# EAGLE design Lipo Rider Plus (EAGLE 9.4.2)
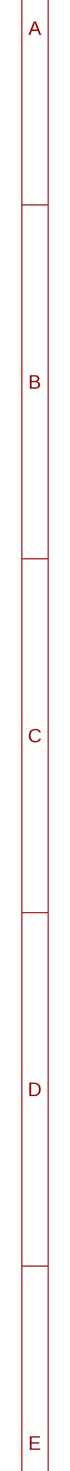
[diagram p0: schematic, sheet 1, part 1 of 2]
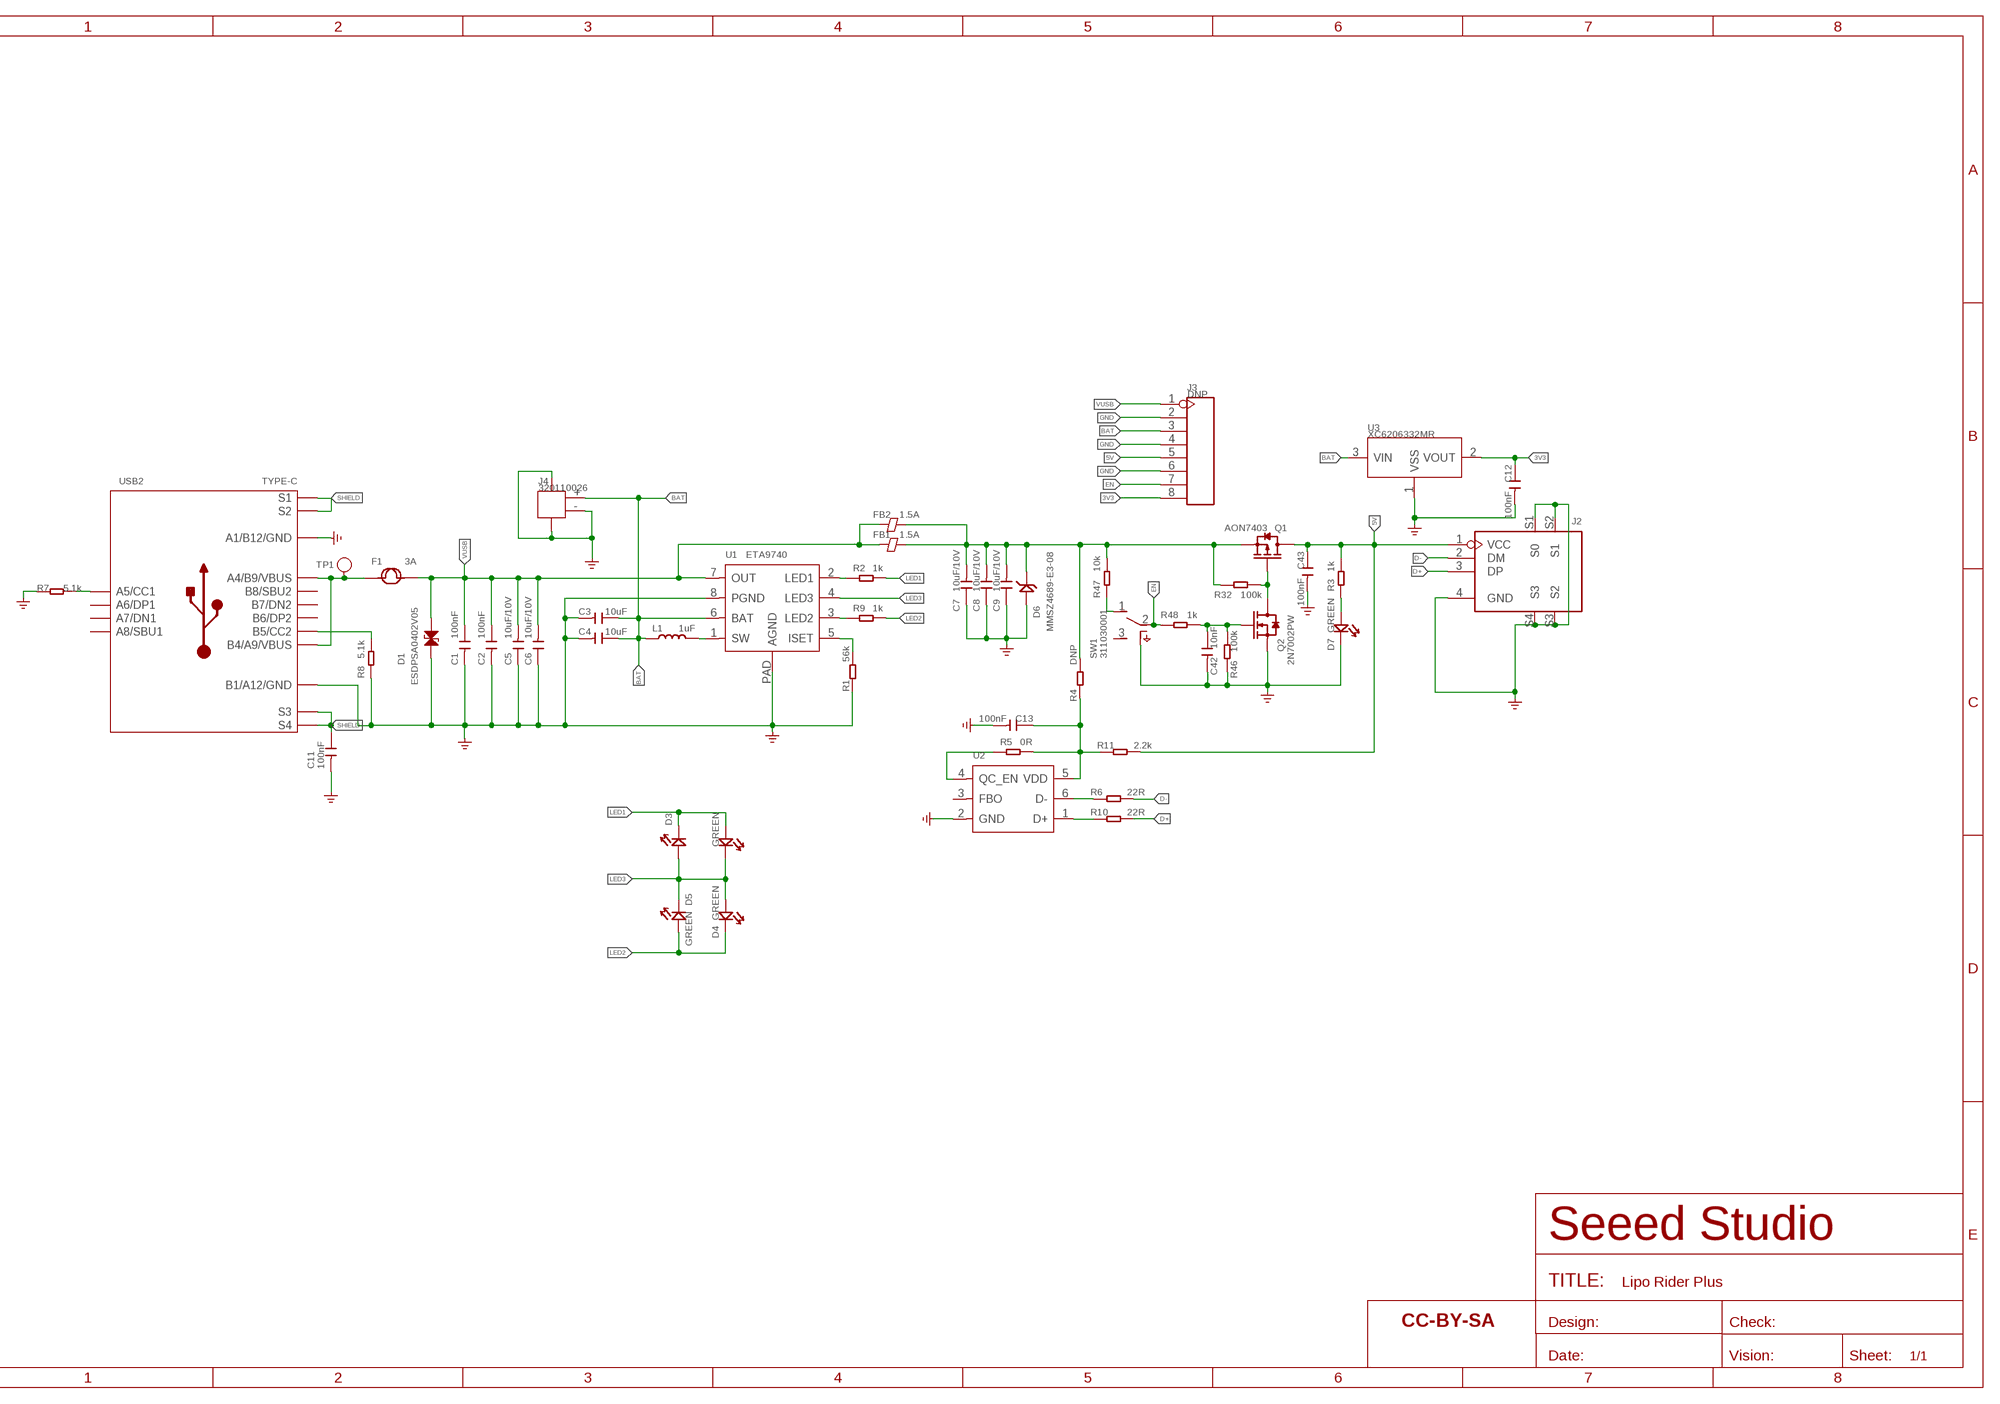
[diagram p1: schematic, sheet 1, part 2 of 2]

## Parts
C1  100nF  CAP-0402  [C0402]
C2  100nF  CAP-0402  [C0402]
C3  10uF  CAP-0603  [C0603]
C4  10uF  CAP-0603  [C0603]
C5  10uF/10V  CAP-0805  [C0805]
C6  10uF/10V  CAP-0805  [C0805]
C7  10uF/10V  CAP-0805  [C0805]
C8  10uF/10V  CAP-0805  [C0805]
C9  10uF/10V  CAP-0805  [C0805]
C11  100nF  CAP-0402  [C0402]
C12  100nF  CAP-0402  [C0402]
C13  100nF  CAP-0402  [C0402]
C42  10nF  CAP-0402  [C0402]
C43  100nF  CAP-0402  [C0402]
D1  ESDPSA0402V05  D-ESD-2P-DOUBLE-0402  [ESD-0402]
D2  GREEN  LED-0402  [LED-0402]
D3  GREEN  LED-0402  [LED-0402]
D4  GREEN  LED-0402  [LED-0402]
D5  GREEN  LED-0402  [LED-0402]
D6  MMSZ4689-E3-08  D-ZENER-2P-304030008  [SOD-123]
D7  GREEN  LED-0402  [LED-0402]
F1  3A  FUSE'1812'  [F1812]
FB1  1.5A  FERRITE-BEAD-0805  [F0805]
FB2  1.5A  FERRITE-BEAD-0805  [F0805]
FR1  SEEEDSTUDIO-OPEN-SCH-FRAME-BIG  [SEEEDSTUDIO-PCB-FRAME]
J2  USB4+4P-SMD+DIP  [USB4+4P-2.0-14.6X10.6X5.72MM]
J3  DNP  HEADER-8P-65/35MIL  [H8-2.54-C65D35MIL]
J4  320110026  JST-2P-SMD'2.0'  [HW2-SMD-2.0-90D]
L1  1uF  INDUCTOR-4430  [L4.4X3.0MM]
Q1  AON7403  MOSFET-P-AON7403  [DFN8P-0.65-3X3X0.8MM]
Q2  2N7002PW  MOSFET-N'SI1304BDL'  [SOT-323]
R1  56k  RES-0402  [R0402]
R2  1k  RES-0402  [R0402]
R3  1k  RES-0402  [R0402]
R4  DNP  RES-0402  [R0402]
R5  0R  RES-0402  [R0402]
R6  22R  RES-0402  [R0402]
R7  5.1k  RES-0402  [R0402]
R8  5.1k  RES-0402  [R0402]
R9  1k  RES-0402  [R0402]
R10  22R  RES-0402  [R0402]
R11  2.2k  RES-0402  [R0402]
R32  100k  RES-0402  [R0402]
R46  100k  RES-0402  [R0402]
R47  10k  RES-0402  [R0402]
R48  1k  RES-0402  [R0402]
SW1  311030001  SWITCH-3+4P-311030001  [SW7-SMD-L6.7X2.7X3.2MM]
TP1  TEST  TEST-POINT'4545'  [TP-D45MIL]
U1  ETA9740  PMIC-ETA9740  [ESOP8L-1.27-5X3.9MM]
U2  CONTROLLER-FP6601Q  [SOT-23-6]
U3  XC6206332MR  PMIC-XC6206PMR  [SOT-23]
USB2  TYPE-C  USB2.0-TYPE-C  [USB2.0-TYPE-C]

## Nets
3V3: C12.1 J3.8 U3.2(VOUT)
5V: C43.1 J2.1(VCC) J3.5 Q1.5(D) Q1.6(D) Q1.7(D) Q1.8(D) Q1.9(D) R3.2 R11.2
BAT: C3.1 C4.1 J3.3 J4.+ L1.1 U1.6(BAT) U3.3(VIN)
D+: J2.3(DP) R10.2
D-: J2.2(DM) R6.2
EN: J3.7 R48.1 SW1.2(COM)
GND: C1.2 C2.2 C3.2 C4.2 C5.1 C6.1 C7.1 C8.1 C9.1 C11.2 C12.2 C13.2 C42.2 C43.2 D1.1 D6.+ D7.- J2.4(GND) J2.S1(S0) J2.S2(S1) J2.S3(S2) J2.S4(S3) J3.2 J3.4 J3.6 J4.3 J4.4 J4.- Q2.2(S) R1.1 R7.1 R8.2 R46.1 SW1.SS1(SS2) SW1.SS2 SW1.SS3(SS2) SW1.SS4(SS2) U1.8(PGND) U1.PAD(AGND) U2.2(GND) U3.1(VSS) USB2.A1_B12(A1/B12/GND) USB2.B1_A12(B1/A12/GND) ; supply symbol labelled GND_POWER
LED1: D2.+ D3.- R2.2
LED2: D4.- D5.+ R9.2
LED3: D2.- D3.+ D4.+ D5.- U1.4(LED3)
N$1: R7.2 USB2.A5(A5/CC1)
N$2: R8.1 USB2.B5(B5/CC2)
N$3: R47.1 SW1.1(A)
N$4: F1.1 TP1.T USB2.A4_B9(A4/B9/VBUS) USB2.B4_A9(B4/A9/VBUS)
N$6: D7.+ R3.1
N$7: R1.2 U1.5(ISET)
N$8: L1.2 U1.1(SW)
N$9: R9.1 U1.3(LED2)
N$10: R5.1 U2.4(QC_EN)
N$11: C13.1 R4.1 R5.2 R11.1 U2.5(VDD)
N$12: R2.1 U1.2(LED1)
N$13: R6.1 U2.6(D-)
N$14: R10.1 U2.1(D+)
N$49: Q1.4(G) Q2.3(D) R32.2
N$52: C42.1 Q2.1(G) R46.2 R48.2
SHIELD: C11.1 USB2.S1 USB2.S2 USB2.S3 USB2.S4 USB2.S5(S1) USB2.S6(S2)
VCC_5V: C7.2 C8.2 C9.2 D6.- FB1.2 FB2.2 Q1.1(S) Q1.2(S) Q1.3(S) R4.2 R32.1 R47.2
VUSB: C1.1 C2.1 C5.2 C6.2 D1.2 F1.2 FB1.1 FB2.1 J3.1 U1.7(OUT)
Unconnected: SW1.3(B) U2.3(FBO) USB2.A6(A6/DP1) USB2.A7(A7/DN1) USB2.A8(A8/SBU1) USB2.B6(B6/DP2) USB2.B7(B7/DN2) USB2.B8(B8/SBU2)

## Library data of the parts
C1-C9 C11-C13 C42 C43 = Discrete-new:CAP: Ceramic Capacitors
D1 = Discrete-new:D-ESD-2P-DOUBLE
D2-D5 D7 = Discrete-new:LED
D6 = Discrete-new:D-ZENER-2P
F1 = Discrete-new:FUSE
FB1 FB2 = Discrete-new:FERRITE-BEAD
FR1 = moudle-new:SEEEDSTUDIO-OPEN-SCH-FRAME-BIG
J2 = Connector-new:USB4+4P
J3 = Connector-new:HEADER-8P
J4 = Connector-new:JST-2P-SMD
L1 = Discrete-new:INDUCTOR
Q1 = Discrete-new:MOSFET-P
Q2 = Discrete-new:MOSFET-N: IRLL014: http://www.vishay.com/docs/91319/sihll014.pdf
R1-R11 R32 R46-R48 = Discrete-new:RES
SW1 = Discrete-new:SWITCH-3+4P
TP1 = Discrete-new:TEST-POINT; PARTNO: DNP
U1 = IC-new:PMIC-ETA9740
U2 = IC-new:CONTROLLER-FP6601Q
U3 = IC-new:PMIC-XC6206P: LOW ESR Cap.Compatible Positive Voltage Regulators
USB2 = Connector-new:USB2.0-TYPE-C

## Board
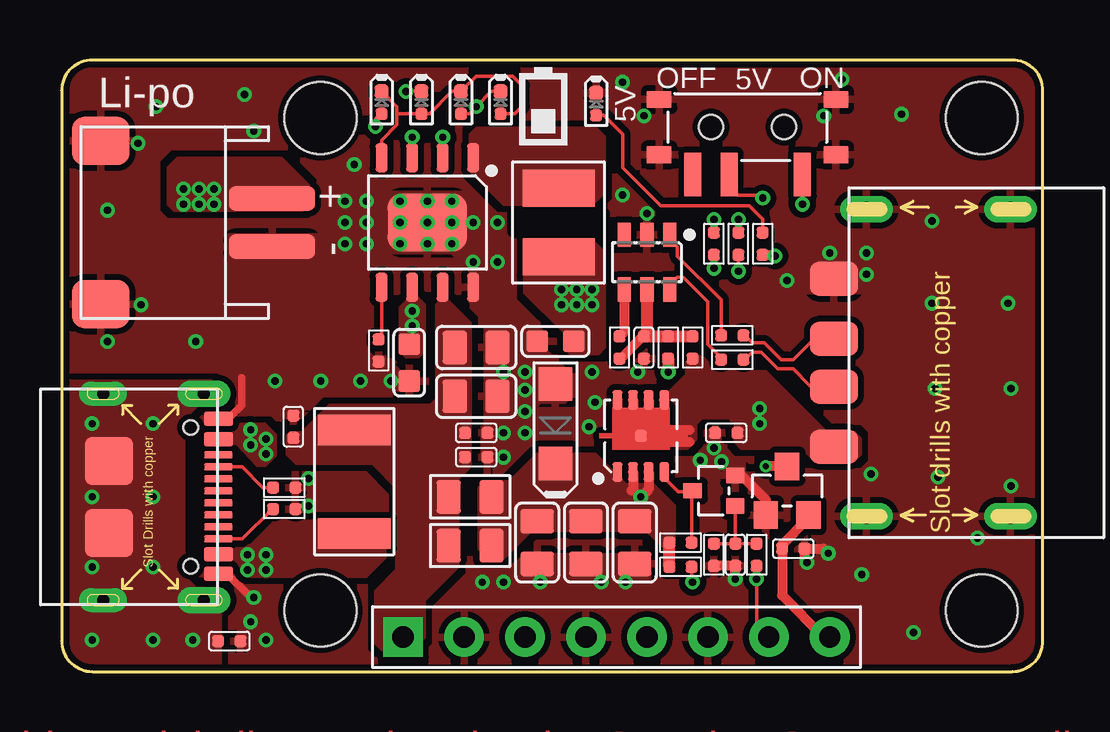
[diagram p2: board, top side]
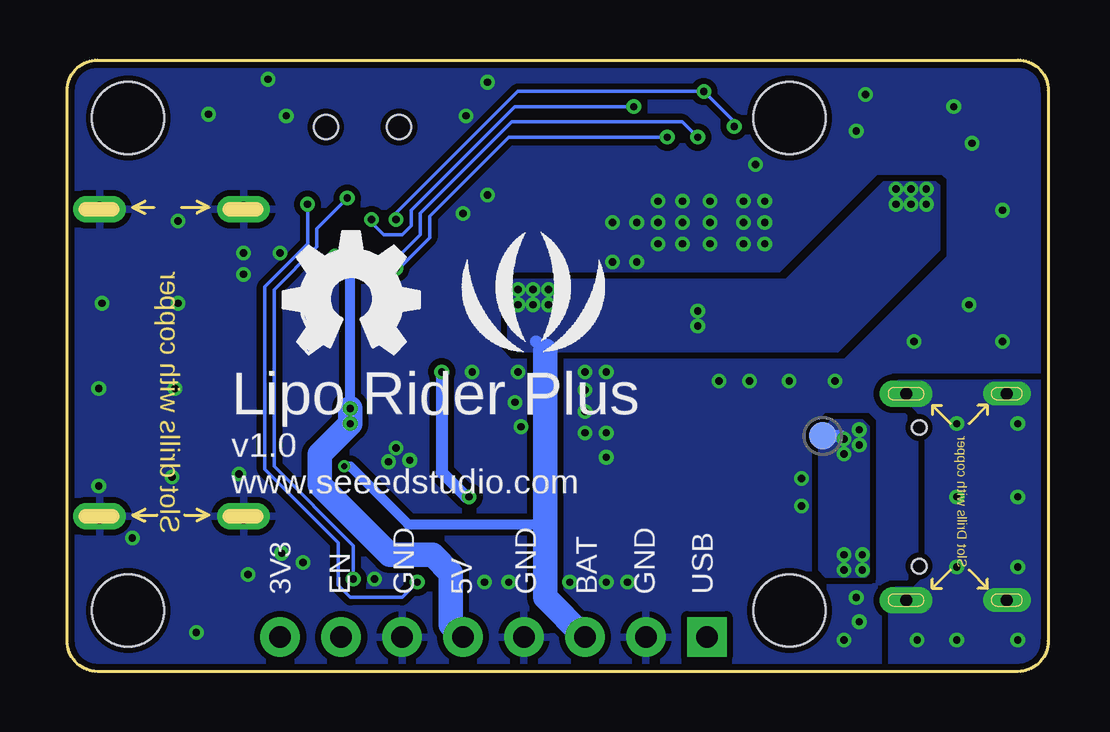
[diagram p3: board, bottom side, seen from below]

Size 40.88 x 25.48 mm. Coordinates in mm from the lower left corner, seen from the top.
Outline: 0,24.21 0,1.27 arc90 1.27,0 39.61,0 arc90 40.88,1.27 40.88,24.21 arc90 39.61,25.48 1.27,25.48 arc90 0,24.21
Copper layers (1*16): Top 0.035mm / dielectric 1.5mm / Bottom 0.035mm
Design rules "SeeedStudio_2layer_DRU_no_angle_20140221 *": minimum track width 1mil, minimum drill 10mil, track to track 6mil, track to pad 6mil, pad to pad 6mil, via to via 6mil, smd to smd 0mil, copper to edge 10mil, drill to drill 10mil, minimum pad ring 4mil, minimum via ring 4mil, stop-mask expansion 2mil, vias tented up to drill 25mil, thermal gap 10mil
Holes 3 mm at 10.78,23.07 10.78,2.54 38.34,23.07 38.34,2.54
tRestrict: area 18.8,18.3 to 22.6,19.1

### Footprints (pad centres in the part's own frame; a part is rotated, then mirrored left to right if it is on the bottom)
C0402 = smd 0.5 x 0.5: 1 -0.463,0; 2 0.463,0
C0603 = smd 0.889 x 0.889: 1 -0.762,0; 2 0.762,0
C0805 = smd 1.016 x 1.397: 1 -0.889,0; 2 0.889,0
ESD-0402 = smd 0.5 x 0.5: 1 -0.463,0; 2 0.463,0
LED-0402 = smd 0.5 x 0.5: + 0.463,0 | smd 0.58 x 0.58: - -0.468,0
SOD-123 = smd 1.397 x 1.397: + 1.651,0; - -1.651,0
F1812 = smd 1.27 x 3.048: 1 -2.159,0; 2 2.159,0
F0805 = smd 1.016 x 1.397: 1 -0.889,0; 2 0.889,0
USB4+4P-2.0-14.6X10.6X5.72MM = smd 1.4 x 2: 1 -3.5,0; 2 -1,0; 3 1,0; 4 3.5,0 | drill 0.6 pad 1.1 long: S1 -6.4,-1.35; S2 6.4,-1.35; S3 -6.4,-7.35; S4 6.4,-7.35
H8-2.54-C65D35MIL = drill 0.889 pad 1.651 square: 1 0,8.89 | drill 0.889 pad 1.651: 2 0,6.35; 3 0,3.81; 4 0,1.27; 5 0,-1.27; 6 0,-3.81; 7 0,-6.35; 8 0,-8.89
HW2-SMD-2.0-90D = smd 2 x 2.4: 3 3.4,-2.181; 4 -3.4,-2.181 | smd 1 x 3.6: + -1,4.953; - 1,4.953
L4.4X3.0MM = smd 1.55 x 3: 1 -1.425,0; 2 1.425,0
DFN8P-0.65-3X3X0.8MM = smd 0.8 x 0.4: 1 -1.5,0.975; 2 -1.5,0.325; 3 -1.5,-0.325; 4 -1.5,-0.975; 5 1.5,-0.975; 6 1.5,-0.325; 7 1.5,0.325; 8 1.5,0.975 | smd 0.508 x 0.508: 9 0,0
SOT-323 = smd 0.762 x 0.635: 1 0.889,-0.635; 2 0.889,0.635; 3 -0.889,0
R0402 = smd 0.5 x 0.5: 1 -0.463,0; 2 0.463,0
SW7-SMD-L6.7X2.7X3.2MM = smd 1.8 x 0.7: 1 1.978,2.286; 2 1.978,-0.762; 3 1.978,-2.286 | smd 0.7 x 1.016: SS1 -1.15,-3.683; SS2 1.15,-3.683; SS3 1.15,3.683; SS4 -1.15,3.683 | hole 1: 0,-1.524; 0,1.524
TP-D45MIL = smd 1.143 x 1.143: T 0,0
ESOP8L-1.27-5X3.9MM = smd 0.5 x 1.2: 1 -1.905,-2.7; 2 -0.635,-2.7; 3 0.635,-2.7; 4 1.905,-2.7; 5 1.905,2.7; 6 0.635,2.7; 7 -0.635,2.7; 8 -1.905,2.7 | smd 3.3 x 2.4: PAD 0,0
SOT-23-6 = smd 0.55 x 1.016: 1 -0.95,-1.143; 2 0,-1.143; 3 0.95,-1.143; 4 0.95,1.143; 5 0,1.143; 6 -0.95,1.143
SOT-23 = smd 1.016 x 1.143: 1 -0.889,-1.016; 2 0.889,-1.016; 3 0,1.016
USB2.0-TYPE-C = smd 1.2 x 0.6: A1_B12 0.05,3.25; A4_B9 0.05,2.4; B1_A12 0.05,-3.2; B4_A9 0.05,-2.4 | smd 1.2 x 0.3: A5 0.05,1.25; A6 0.05,0.25; A7 0.05,-0.25; A8 0.05,-1.25; B5 0.05,-1.75; B6 0.05,-0.75; B7 0.05,0.75; B8 0.05,1.75 | drill 0.5 pad 1 long: S1 -4.75,4.3; S2 -4.75,-4.3 | drill 0.5 pad 1.1 long: S3 -0.55,4.3; S4 -0.55,-4.3 | smd 2 x 2: S5 -4.5,1.5; S6 -4.5,-1.5 | hole 0.6: -1.1,-2.89; -1.1,2.89

### Placement (x,y rotation side)
C1  17.27,8.93 0 top
C2  17.27,9.95 0 top
C3  14.48,12.87 270 top
C4  20.57,13.76 180 top
C5  17.27,11.47 180 top
C6  17.27,13.5 180 top
C7  21.84,5.37 90 top
C8  19.81,5.37 90 top
C9  23.88,5.37 90 top
C11  6.99,1.27 0 top
C12  30.48,5.12 0 top
C13  24.26,13.5 270 top
C42  28.07,4.87 270 top
C43  27.69,9.95 180 top
D1  9.65,10.2 270 top
D2  13.34,23.7 270 top
D3  14.99,23.7 270 top
D4  18.29,23.7 270 top
D5  16.64,23.7 270 top
D6  20.57,10.33 90 top
D7  22.27,23.64 270 top
F1  12.19,7.91 90 top
FB1  17.02,5.25 0 top
FB2  17.02,7.28 0 top
FR1  -2.79,-7.58 0 top  (outside the outline)
J2  32.18,12.87 90 top
J3  23.11,1.44 90 top
J4  3.81,18.71 270 top
L1  20.7,18.71 90 top
Q1  24.13,9.82 90 top
Q2  27.18,7.53 0 top
R1  13.21,13.38 90 top
R2  27.18,17.82 90 top
R3  29.21,17.82 270 top
R4  25.27,13.5 270 top
R5  23.24,13.5 270 top
R6  27.94,12.99 0 top
R7  9.27,7.66 180 top
R8  9.27,6.77 0 top
R9  28.19,17.82 90 top
R10  27.94,14.01 0 top
R11  26.29,13.5 270 top
R32  25.78,5.37 0 top
R46  27.18,4.87 90 top
R47  25.78,4.36 180 top
R48  28.96,4.87 90 top
SW1  28.57,22.69 270 top
TP1  9.4,9.82 0 bottom
U1  15.24,18.71 180 top
U2  24.38,17.06 180 top
U3  30.23,7.53 0 top
U$1  [SEEED-SILK-TNAME-280*268MIL]  21.46,15.03 0 bottom
U$2  [OSHW_FILLX200_NOTEXT_TNAME]  31.88,13.25 0 bottom
USB2  6.48,7.28 0 top

### Tracks (layer width: path | path; a pad name or v marks a point on that pad's centre or on a via)
3V3
  Top 0.406: U3.2 31.11,6.39 30.02,5.29 C12.1 30.02,3.17 31.75,1.44 J3.8
5V  (via drill 0.3 pad 0.61)
  Top 0.406: 29.04,11.01 v29.08,10.96 | R3.2 29.67,17.36 v29.72,17.31 | Q1.5 25.11,10.54 25.02,10.45 | Q1.6 24.45,10.64 25.02,10.07 25.15,10.07 | Q1.7 23.8,10.4 23.88,10.33 | Q1.8 23.16,10.41 23.24,10.33 | 25.15,10.07 26.16,10.07 | 25.15,10.07 25.15,9.69 25.27,9.56 25.91,9.56 | 25.91,9.56 26.16,9.56 | 25.91,9.56 25.91,9.95
  Bottom 0.406: v29.08,10.96 29.08,16.68 v29.72,17.31
  Bottom 1.016: v29.08,10.96 v29.08,10.33 30.35,9.06 30.35,7.79 27.43,4.87 25.65,4.87 24.89,4.1 24.89,2.45 24.89,2.2 24.89,1.95 J3.5
  pour Top (isolate 0.254, no thermals): 33.02,8.8 31.37,8.8 30.86,9.31 28.32,9.31 28.07,9.56 28.07,10.33 27.81,10.58 26.67,10.58 26.42,10.33 26.42,9.67 26.06,9.31 23.37,9.31 22.99,9.69 22.99,10.58 23.24,10.84 24.89,10.84 25.15,11.09 25.15,11.47 26.04,12.36 26.04,12.87 26.29,13.12 26.67,13.12 27.3,12.49 29.34,12.49 31.88,9.95 33.02,9.95 33.27,9.69 33.27,9.06
BAT  (via drill 0.25 pad 0.51, 0.3 pad 0.61)
  Top 0.406: U3.3 v29.34,8.55
  Bottom 0.406: 20.95,6.26 21.08,6.14 26.67,6.14 29.08,8.55 v29.34,8.55
  Bottom 0.508: 20.95,13.38 C4.1
  Bottom 1.016: 20.95,13.38 20.95,6.26 20.95,3.09 J3.3
  other vias: 22.1,15.28 21.46,15.28 21.46,15.91 22.1,15.91 20.83,15.91 20.83,15.28 6.35,20.11 6.35,19.47 5.71,19.47 5.71,20.11 5.08,20.11 5.08,19.47 14.61,15.03 14.61,14.39
  pour Top (isolate 0.254, no thermals): 10.03,19.22 4.7,19.22 4.45,19.47 4.45,21 4.83,21.38 9.14,21.38 10.29,20.23 10.29,19.47
  pour Top (isolate 0.254, no thermals): 14.61,16.3 14.48,16.17 14.48,15.53 14.1,15.15 14.1,13.38 14.35,13.12 14.86,13.12 15.11,13.38 15.11,15.28 14.86,15.53 14.73,15.66 14.73,16.17
  pour Top (isolate 0.254, no thermals): 22.1,13.25 21.21,13.25 20.95,13.5 20.95,14.14 19.3,15.79 19.3,17.69 19.56,17.95 22.1,17.95 22.61,17.44 22.61,13.5 22.35,13.25
  pour Bottom (isolate 0.254, no thermals): 21.84,16.3 10.92,16.3 6.86,20.36 4.7,20.36 4.57,20.23 4.57,17.57 8.76,13.38 22.1,13.38 22.48,13.76 22.48,16.04 22.23,16.3
D+
  Top 0.152: R10.2 28.45,14.01 28.77,13.69 29.27,13.69 29.97,12.99 30.48,12.99 31.35,13.87 J2.3
D-
  Top 0.152: R6.2 28.45,12.99 28.77,13.31 29.15,13.31 29.84,12.61 30.48,12.61 31.18,11.91 31.23,11.87 J2.2
EN  (via drill 0.3 pad 0.61)
  Top 0.152: 28.96,4.49 R48.1 v28.96,3.85 28.96,1.95 J3.7 | v29.21,19.73 29.08,19.85 28.19,19.85 27.81,20.23 SW1.2
  Bottom 0.152: v28.96,3.85 28.96,5.25 32.26,8.55 32.26,15.91 30.48,17.69 30.48,18.45 v29.21,19.73
GND  (via drill 0.3 pad 0.61)
  Top 0.305: USB2.B1_A12 6.88,4.08 7.75,3.21 | USB2.A1_B12 6.93,10.53 7.49,11.09 7.49,12.23
  Top 0.406: R46.1 C42.2 v28.07,3.85 | Q2.2 28.32,8.17 29.34,7.15 U3.1 | v31.05,4.55 30.94,4.66 C12.2 31.75,5.12 v31.94,4.93
  other vias: 18.41,9.95 18.41,8.93 19.3,9.95 19.3,10.84 19.3,11.72 19.3,12.49 18.41,12.49 15.24,18.71 15.24,19.6 15.24,17.82 14.1,17.82 14.1,18.71 14.1,19.6 16.26,19.6 16.26,18.71 16.26,17.82 17.14,17.06 18.16,17.06 18.16,18.71 17.14,18.71 12.7,19.6 12.7,18.71 12.7,17.82 11.81,17.82 11.81,18.71 11.81,19.6 13.72,12.11 12.45,12.11 10.79,12.11 8.89,12.11 3.3,15.28 3.17,22.01 19.94,3.72 18.41,3.72 17.53,3.72 22.48,3.72 23.5,3.72 24,12.49 27.18,9.31 26.61,8.8 27.5,8.74 24.38,19.09 23.37,24.55 24.26,23.15 32.51,24.68 31.75,23.15 8,3.09 7.87,2.07 8.51,1.31 3.94,23.54 7.62,24.04 1.91,19.22 5.59,13.76 22.1,12.49 32,17.44 33.53,17.44 33.53,16.55 30.23,16.3 23.37,19.85 22.23,11.22 21.97,10.2 1.91,13.76 8,22.52 12.19,21.12 10.29,8.04 10.29,6.9 33.72,8.23 33.34,4.04 38.16,5.56 39.56,7.72 36.51,8.1 36.39,11.79 39.56,11.79 39.43,15.34 36.26,15.34 36.26,18.77 34.99,23.22 35.5,1.63
  pour Top (isolate 0.254, no thermals): 17.65,8.68 18.41,8.68 19.56,9.82 19.56,10.84 19.94,11.22 20.95,11.22 21.21,11.47 22.23,11.47 22.35,11.6 22.35,12.11 22.1,12.36 21.21,12.36 20.19,13.38 20.19,14.01 18.54,15.66 18.54,18.71 18.29,18.96 17.91,18.96 16.89,19.98 11.81,19.98 11.56,19.73 11.56,18.96 10.79,18.2 6.99,18.2 6.99,13.38 8.64,11.72 8.64,10.96 9.02,10.58 9.78,10.58 10.92,11.72 14.48,11.72 14.73,11.98 14.73,12.36 14.61,12.49 14.1,12.49 13.46,13.12 12.97,13.12 12.67,13.42 12.67,16.77 13.34,17.44 16.26,17.44 17.02,16.68 17.02,15.41 17.65,14.77 17.65,10.33 17.53,10.2 17.53,8.8
  pour Top (isolate 0.254, no thermals): 23.75,4.87 24.13,4.87 24.51,4.49 24.51,3.34 24.13,2.96 16.76,2.96 16.51,3.21 16.51,3.6 17.02,4.1 18.54,4.1 19.3,4.87
  pour Top (isolate 0.254, no thermals): 27.05,10.07 26.92,9.95 26.92,9.44 26.42,8.93 26.42,8.55 26.54,8.42 27.56,8.42 27.94,8.04 28.32,8.04 28.45,8.17 28.45,8.68 28.19,8.8 28.07,8.8 27.43,9.56 27.43,9.95 27.3,10.07
  pour Top (isolate 0.254, no thermals): 8.38,3.47 8.13,3.47 7.37,2.71 7.37,1.18 7.62,0.93 8.64,0.93 8.89,1.18 8.89,3.09 8.51,3.47
  pour Top (isolate 0.254, no thermals): 32.51,15.79 33.91,15.79 34.29,16.17 34.29,17.44 34.04,17.69 30.99,17.69 29.97,16.68 29.97,16.17 30.23,15.91 30.35,15.79
  pour Top (isolate 0.254, rank 6): -0.64,26.07 41.7,26.07 41.7,-0.59 -0.64,-0.59
  pour Bottom (isolate 0.254, rank 6): -0.64,26.07 41.7,26.07 41.7,-0.59 1.91,-0.59 1.91,-1.23 -0.64,-1.23
  pour Top (isolate 0.254): 31.62,5.63 31.24,5.63 30.73,5.12 30.73,3.47 30.99,3.21 31.24,3.21 31.5,3.47 31.5,3.98 32.13,4.61 32.13,5.25 31.75,5.63
LED1  (via drill 0.3 pad 0.61)
  Top 0.152: D2.+ 13.29,23.24 13.08,23.03 v13.08,22.71 | R2.2 v27.18,18.84 | D3.- v14.35,24.17
  Bottom 0.152: v27.18,18.84 27.18,19.09 22.1,24.17 v14.35,24.17 13.08,22.9 v13.08,22.71
LED2  (via drill 0.3 pad 0.61)
  Top 0.152: R9.2 v28.19,18.84 | D4.- 17.91,24.17 v17.27,23.54 16.98,23.24 D5.+
  Bottom 0.152: v17.27,23.54 22.23,23.54 26.54,19.22 26.54,18.58 26.92,18.2 27.69,18.2 28.19,18.71 v28.19,18.84
LED3
  Top 0.152: U1.4 13.34,22.14 13.97,22.77 13.97,23.28 | 13.97,23.28 13.97,23.54 D2.- | D2.- | 13.97,23.28 14.01,23.24 D3.+ 15.32,23.24 16.26,24.17 D5.- 17.27,24.8 18.8,24.8 19.18,24.42 19.18,23.54 18.88,23.24 D4.+
N$1
  Top 0.152: USB2.A5 7.51,8.53 8.38,7.66 R7.2
N$2
  Top 0.152: USB2.B5 7.52,5.53 8.76,6.77 R8.1
N$3  (via drill 0.3 pad 0.61)
  Top 0.152: R47.1 26.24,3.77 v26.29,3.72 | SW1.1 v30.86,19.47
  Bottom 0.152: v26.29,3.72 26.92,3.09 29.08,3.09 29.59,3.6 29.59,5.37 32.64,8.42 32.64,16.04 30.86,17.82 v30.86,19.47
N$4  (via drill 0.3 pad 0.61)
  Bottom 0.508: TP1.T 8.64,9.82 v8.51,9.69
  other vias: 8.51,9.06 7.87,9.44 7.87,10.07 7.75,4.87 8.51,4.87 8.51,4.23 7.75,4.23
  pour Top (isolate 0.254, no thermals): 6.16,9.82 6.99,9.82 7.47,10.3 8.45,10.3 8.89,9.86 8.89,9.01 8.48,8.59 8.15,8.59 7.3,9.5 6.22,9.5 6.1,9.63 6.1,9.76
  pour Bottom (isolate 0.254, no thermals): 7.87,10.45 7.75,10.45 7.49,10.2 7.49,4.1 7.62,3.98 9.27,3.98 9.53,4.23 9.53,9.95 9.02,10.45
  pour Top (isolate 0.254, no thermals): 6.35,4.99 7.11,4.99 7.37,5.25 7.87,5.25 8.89,6.26 13.21,6.26 13.46,6.01 13.46,4.74 12.7,3.98 7.87,3.98 7.11,4.74 6.35,4.74 6.22,4.87
N$6
  Top 0.152: R3.1 29.21,18.84 28.64,19.41 24.96,19.41 23.37,21 23.37,22.39 22.58,23.18 D7.+
N$7
  Top 0.152: U1.5 13.34,13.96 R1.2
N$8
  pour Top (isolate 0.254, no thermals): 17.02,20.87 17.02,22.36 17.3,22.65 22.25,22.65 22.61,22.29 22.61,19.98 22.1,19.47 18.41,19.47
N$9  (via drill 0.3 pad 0.61)
  Top 0.152: U1.3 v14.61,22.27 | v28.19,16.68 R9.1
  Bottom 0.152: v28.19,16.68 27.43,17.44 26.92,17.44 26.16,18.2 26.16,19.09 22.35,22.9 15.24,22.9 v14.61,22.27
N$10
  Top 0.406: U2.4 23.43,14.16 R5.1
N$11
  Top 0.406: R5.2 23.29,13.04 24.21,13.96 C13.1
  Top 0.508: U2.5 24.38,14.14 24.26,14.01 C13.1 R4.1 R11.1
N$12  (via drill 0.3 pad 0.61)
  Top 0.152: U1.2 v15.88,22.27 | R2.1 v27.18,16.8
  Bottom 0.152: v15.88,22.27 22.48,22.27 25.78,18.96 25.78,18.07 27.05,16.8 v27.18,16.8
N$13
  Top 0.152: R6.1 27.48,13.07 26.92,13.63 26.92,15.41 25.91,16.42 25.65,16.42 25.33,16.1 U2.6
N$14
  Top 0.152: R10.1 27.48,15.49 25.65,17.31 25.65,17.69 25.33,18.01 U2.1
N$49
  Top 0.152: Q1.4 25.11,8.08 25.7,7.49 26.24,7.49 | R32.2 26.24,7.49 | 26.24,7.49 Q2.3
N$52
  Top 0.152: C42.1 R48.2 | C42.1 R46.2 | C42.1 Q2.1
SHIELD  (via drill 0.3 pad 0.61)
  other vias: 5.46,1.31 3.81,1.31 1.27,1.31 1.27,4.36 3.81,4.36 3.81,7.28 1.27,7.28 1.27,10.33 3.81,10.33
  pour Top (isolate 0.254, no thermals): 0,12.11 6.22,12.11 6.48,11.85 6.48,11.47 6.22,11.22 5.76,11.22 5.08,10.53 5.08,3.98 5.59,3.47 6.35,3.47 6.6,3.21 6.6,0.04 0,0.04
  pour Bottom (isolate 0.254, no thermals): 0,12.11 6.22,12.11 6.48,11.85 6.48,11.47 6.22,11.22 5.82,11.22 5.08,10.48 5.08,3.99 5.6,3.47 6.35,3.47 6.6,3.21 6.6,0.04 0,0.04
VCC_5V  (via drill 0.3 pad 0.61)
  Top 0.406: Q1.2 23.8,7.59 23.75,7.53 | Q1.3 24.45,7.6 v24.13,7.28
  Top 0.508: R4.2 v25.27,12.49 | R47.2 R32.1
  Bottom 0.508: v25.27,12.49 25.27,8.29 24.26,7.28 v24.13,7.28
  pour Top (isolate 0.254, no thermals): 17.91,7.91 18.67,7.91 19.81,9.06 22.23,9.06 23.5,7.79 24.64,7.79 25.4,7.03 25.53,6.9 25.53,5.37 25.4,5.25 25.02,5.25 24.38,5.88 19.56,5.88 18.41,4.74 17.78,4.74 17.4,5.12 17.4,7.66 17.65,7.91
VUSB
  pour Top (isolate 0.254, no thermals): 15.88,16.17 15.75,16.04 15.75,15.41 15.62,15.28 15.62,11.34 15.37,11.09 11.18,11.09 10.03,9.95 9.53,9.95 9.4,9.82 9.4,9.06 9.78,8.68 12.95,8.68 13.97,7.66 13.97,4.23 13.08,3.34 13.08,1.18 13.34,0.93 14.61,0.93 15.11,1.44 15.11,2.96 16.51,4.36 16.51,8.04 17.02,8.55 17.02,14.52 16,15.53 16,16.04

### Text on the board
tNames: OFF | 5V | ON | Li-po | 5V | + | -
bNames: Lipo Rider Plus | v1.0 | www.seeedstudio.com | USB | GND | BAT | GND | 5V | GND | EN | 3V3